# EAGLE schematic interface_board (EAGLE 6.5.0)
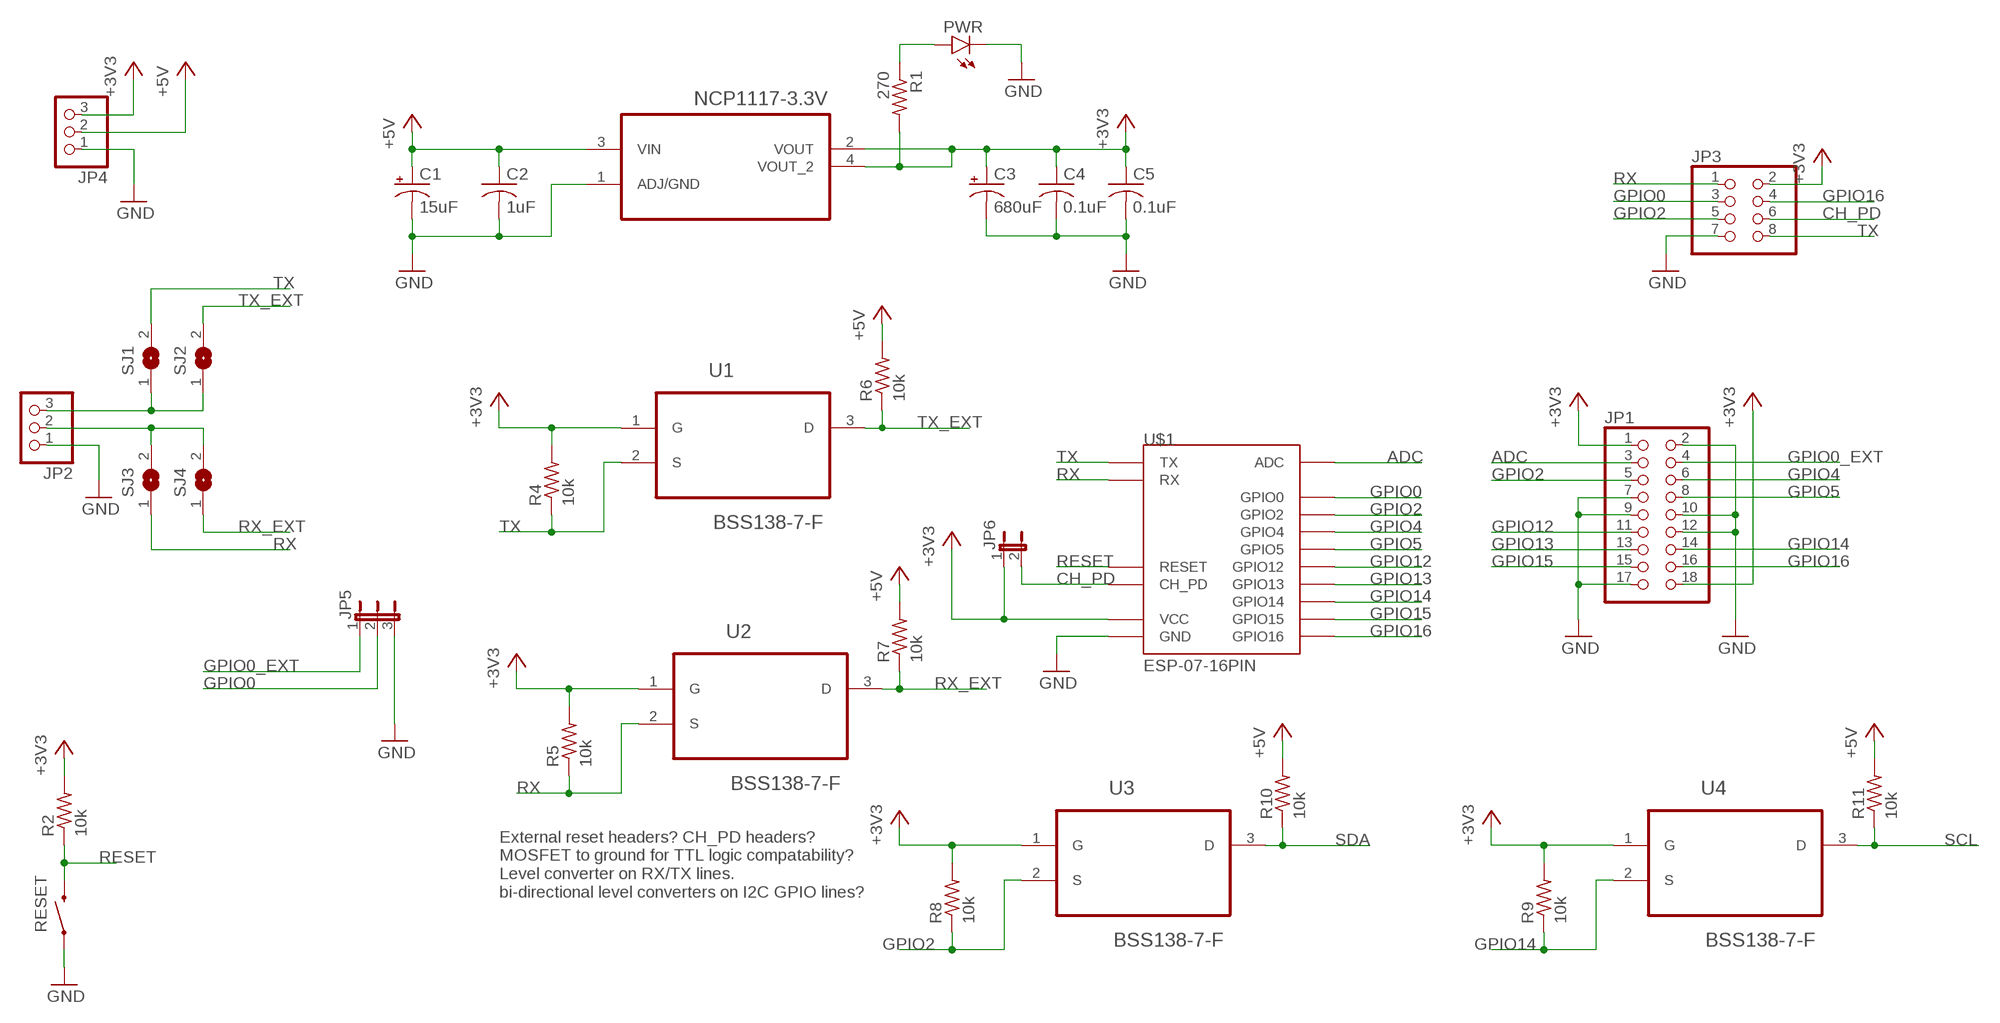
[diagram p0: schematic, sheet 1]

## Parts
C1  15uF  CPOL-USE2-5  [E2-5]
C2  1uF  C-USC1206  [C1206]
C3  680uF  CPOL-USE5-10.5  [E5-10,5]
C4  0.1uF  C-USC1206  [C1206]
C5  0.1uF  C-USC1206  [C1206]
JP1  PINHD-2X9/90  [2X09/90]
JP2  PINHD-1X3  [1X03]
JP3  PINHD-2X4  [2X04]
JP4  PINHD-1X3  [1X03]
JP5  JP2E  [JP2]
JP6  JP1E  [JP1]
NCP1117-3.3V  LM1117IMP-5.0  [SOT230P696X180-4N]
PWR  PURPLE  LED-PURPLE1206  [LED-1206]
R1  270  R-US_R1206  [R1206]
R2  10k  R-US_R1206  [R1206]
R4  10k  R-US_R1206  [R1206]
R5  10k  R-US_R1206  [R1206]
R6  10k  R-US_R1206  [R1206]
R7  10k  R-US_R1206  [R1206]
R8  10k  R-US_R1206  [R1206]
R9  10k  R-US_R1206  [R1206]
R10  10k  R-US_R1206  [R1206]
R11  10k  R-US_R1206  [R1206]
RESET  SWITCH-MOMENTARY-2SMD-REDUNDANT  [TACTILE-SWITCH-SMD]
SJ1  SJ  [SJ]
SJ2  SJ  [SJ]
SJ3  SJ  [SJ]
SJ4  SJ  [SJ]
U1  BSS138-7-F  [SOT95P240X110-3N]
U2  BSS138-7-F  [SOT95P240X110-3N]
U3  BSS138-7-F  [SOT95P240X110-3N]
U4  BSS138-7-F  [SOT95P240X110-3N]
U$1  ESP-07-16PIN  [ESP-07-16PIN]

## Nets
+3V3: C3.+ C4.1 C5.1 JP1.1 JP1.18 JP3.2 JP4.3 JP6.1 NCP1117-3.3V.2(VOUT) NCP1117-3.3V.4(VOUT_2) R1.2 R2.2 R4.2 R5.2 R8.2 R9.2 U1.1(G) U2.1(G) U3.1(G) U4.1(G) U$1.VCC
+5V: C1.+ C2.1 JP4.2 NCP1117-3.3V.3(VIN) R6.2 R7.2 R10.2 R11.2
ADC: JP1.3 U$1.ADC
CH_PD: JP3.6 JP6.2 U$1.CH_PD
GND: C1.- C2.2 C3.- C4.2 C5.2 JP1.2 JP1.7 JP1.9 JP1.10 JP1.12 JP1.17 JP2.1 JP3.7 JP4.1 JP5.3 NCP1117-3.3V.1(ADJ/GND) PWR.C RESET.1 RESET.2 U$1.GND
GPIO0: JP3.3 JP5.2 U$1.GPIO0
GPIO0_EXT: JP1.4 JP5.1
GPIO2: JP1.5 JP3.5 R8.1 U3.2(S) U$1.GPIO2
GPIO4: JP1.6 U$1.GPIO4
GPIO5: JP1.8 U$1.GPIO5
GPIO12: JP1.11 U$1.GPIO12
GPIO13: JP1.13 U$1.GPIO13
GPIO14: JP1.14 R9.1 U4.2(S) U$1.GPIO14
GPIO15: JP1.15 U$1.GPIO15
GPIO16: JP1.16 JP3.4 U$1.GPIO16
N$2: PWR.A R1.1
N$6: JP2.3 SJ1.1 SJ2.1
N$7: JP2.2 SJ3.2 SJ4.2
RESET: R2.1 RESET.3 RESET.4 U$1.REST(RESET)
RX: JP3.1 R5.1 SJ3.1 U2.2(S) U$1.RX
RX_EXT: R7.1 SJ4.1 U2.3(D)
SCL: R11.1 U4.3(D)
SDA: R10.1 U3.3(D)
TX: JP3.8 R4.1 SJ1.2 U1.2(S) U$1.TX
TX_EXT: R6.1 SJ2.2 U1.3(D)

## Notes on the sheet
- External reset headers? CH_PD headers?
  MOSFET to ground for TTL logic compatability?
  Level converter on RX/TX lines.
  bi-directional level converters on I2C GPIO lines?

## Library data of the parts
C1 C3 = rcl:CPOL-US: POLARIZED CAPACITOR, American symbol
C2 C4 C5 = rcl:C-US: CAPACITOR, American symbol
JP1 = pinhead:PINHD-2X9: PIN HEADER
JP2 JP4 = pinhead:PINHD-1X3: PIN HEADER
JP3 = pinhead:PINHD-2X4: PIN HEADER
JP5 = jumper:JP2E: JUMPER
JP6 = jumper:JP1E: JUMPER
NCP1117-3.3V = NCP1117:LM1117IMP-5.0: IC REG LDO 800MA 5.0V; MPN: LM1117IMP-5.0; OC_FARNELL: -; OC_NEWARK: 41K3451; PACKAGE: SOT-223; SUPPLIER: National Semiconductor
PWR = SparkFun-LED:LED-PURPLE: Various green LEDs 0603- DIO-00821 LARGE- DIO-00862 LILYPAD- DIO-09910; PROD_ID: DIO-11140
R1 R2 R4-R11 = rcl:R-US_: RESISTOR, American symbol
RESET = SparkFun-Electromechanical:SWITCH-MOMENTARY-2: Various NO switches- pushbuttons, reed, etc; PROD_ID: SWCH-08247
SJ1-SJ4 = jumper:SJ: SMD solder JUMPER
U1-U4 = bss138_sot_23:BSS138-7-F: ENHANCEMENT MODE MOSFET; MPN: BSS138-7-F; OC_FARNELL: 1843693; OC_NEWARK: 12T1442; PACKAGE: SOT-23-3; SUPPLIER: DIODES INC.
U$1 = esp8266modules:ESP-07-16PIN: ESP8266 Wifi Module ESP-07 - 16 pins; DIMENSIONS: 22.0 x 16.0 mm; PINS: 16; PITCH: 0.078" / 2 mm